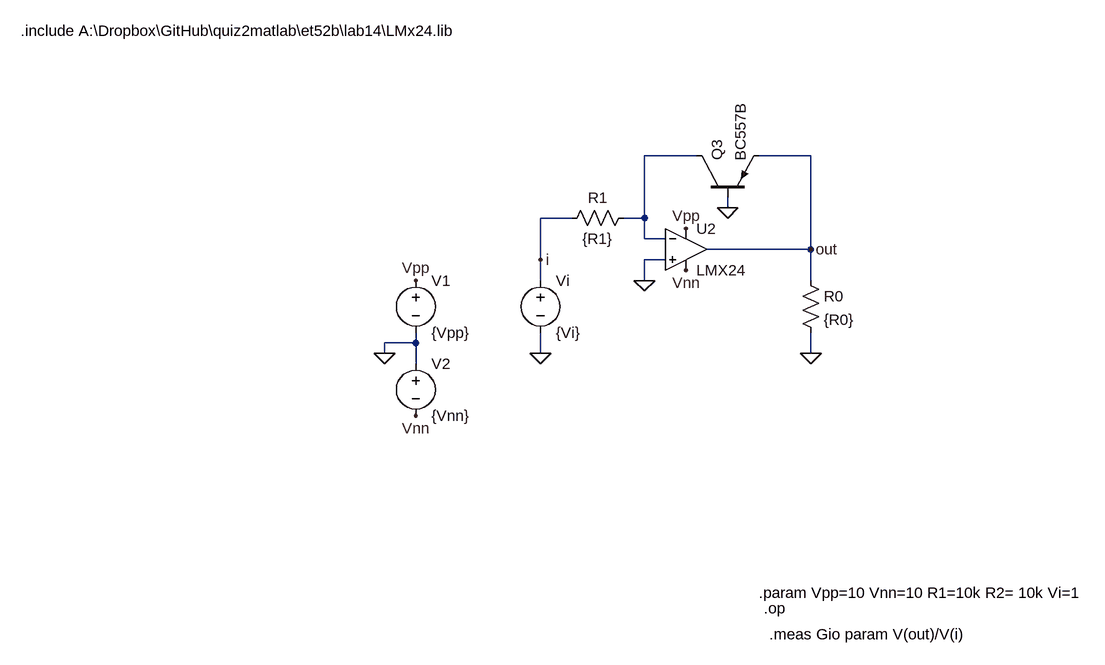
[diagram p0: schematic lab14e.asc]
lab14e.asc, the LTspice schematic file:
Version 4
SHEET 1 988 680
WIRE -208 -96 -288 -96
WIRE -32 -96 -112 -96
WIRE -160 -16 -160 -32
WIRE -400 0 -448 0
WIRE -288 0 -288 -96
WIRE -288 0 -320 0
WIRE -288 32 -288 0
WIRE -256 32 -288 32
WIRE -32 48 -32 -96
WIRE -32 48 -192 48
WIRE -448 64 -448 0
WIRE -256 64 -288 64
WIRE -448 96 -448 64
WIRE -288 96 -288 64
WIRE -32 96 -32 48
WIRE -640 192 -640 176
WIRE -640 192 -688 192
WIRE -688 208 -688 192
WIRE -448 208 -448 176
WIRE -32 208 -32 176
WIRE -640 224 -640 192
FLAG -688 208 0
FLAG -640 96 Vpp
FLAG -640 304 Vnn
FLAG -448 208 0
FLAG -32 48 out
FLAG -32 208 0
FLAG -448 64 i
FLAG -288 96 0
FLAG -160 -16 0
FLAG -224 16 Vpp
FLAG -224 80 Vnn
SYMBOL voltage -640 80 R0
SYMATTR InstName V1
SYMATTR Value {Vpp}
SYMBOL voltage -640 208 R0
SYMATTR InstName V2
SYMATTR Value {Vnn}
SYMBOL voltage -448 80 R0
SYMATTR InstName Vi
SYMATTR Value {Vi}
SYMBOL res -48 80 R0
SYMATTR InstName R0
SYMATTR Value {R0}
SYMBOL res -304 -16 R90
WINDOW 0 0 56 VBottom 2
WINDOW 3 32 56 VTop 2
SYMATTR InstName R1
SYMATTR Value {R1}
SYMBOL Opamps\\opamp2 -224 -16 R0
SYMATTR InstName U2
SYMATTR Value LMX24
SYMBOL pnp -208 -32 R270
SYMATTR InstName Q3
SYMATTR Value BC557B
TEXT -1248 -288 Left 2 !.include A:\\Dropbox\\GitHub\\quiz2matlab\\et52b\\lab14\\LMx24.lib
TEXT -112 576 Left 2 !.param Vpp=10 Vnn=10 R1=10k R2= 10k Vi=1
TEXT -104 600 Left 2 !.op
TEXT -96 640 Left 2 !.meas Gio param V(out)/V(i)

The netlist it stands for:
* lab14e.asc
V1 Vpp 0 {Vpp}
V2 0 Vnn {Vnn}
Vi i 0 {Vi}
R0 out 0 {R0}
R1 N001 i {R1}
XU2 0 N001 Vpp Vnn out LMX24  ; pins In+ In- V+ V- OUT
Q3 N001 0 out 0 BC557B
.model NPN NPN
.model PNP PNP
.lib standard.bjt
.include A:\Dropbox\GitHub\quiz2matlab\et52b\lab14\LMx24.lib
.param Vpp=10 Vnn=10 R1=10k R2= 10k Vi=1
.op
.meas Gio param V(out)/V(i)
.backanno
.end